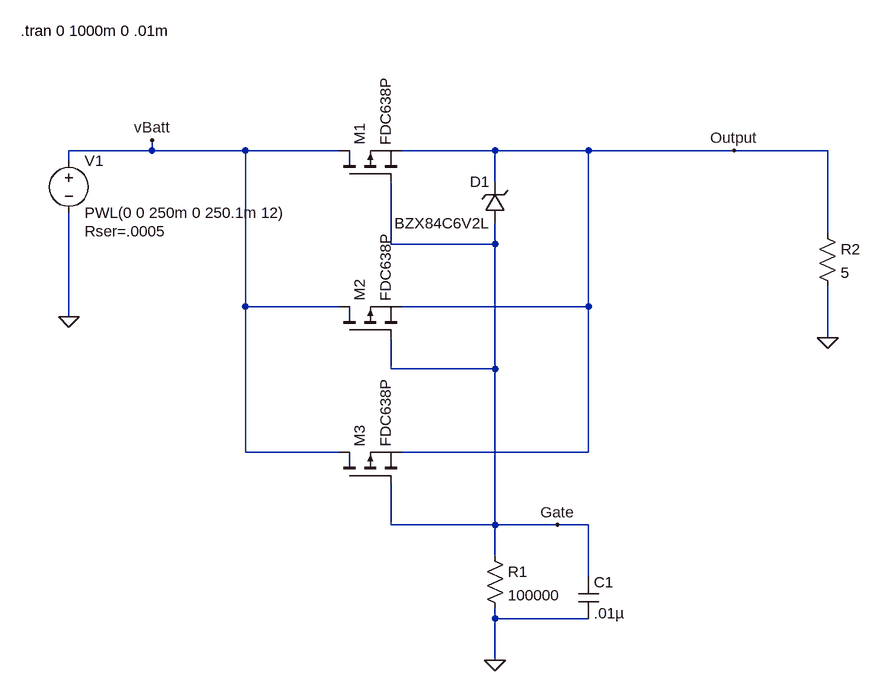
[diagram p0: schematic ReversePolarityProtection.asc]
ReversePolarityProtection.asc, the LTspice schematic file:
Version 4
SHEET 1 920 792
WIRE -176 -32 -176 -48
WIRE -176 -32 -304 -32
WIRE -32 -32 -176 -32
WIRE 112 -32 -32 -32
WIRE 352 -32 208 -32
WIRE 496 -32 352 -32
WIRE 720 -32 496 -32
WIRE 864 -32 720 -32
WIRE -304 -16 -304 -32
WIRE 352 16 352 -32
WIRE 864 96 864 -32
WIRE 192 112 192 16
WIRE 352 112 352 80
WIRE 352 112 192 112
WIRE -32 208 -32 -32
WIRE 112 208 -32 208
WIRE 496 208 496 -32
WIRE 496 208 208 208
WIRE -304 224 -304 64
WIRE 864 256 864 176
WIRE 192 304 192 256
WIRE 352 304 352 112
WIRE 352 304 192 304
WIRE -32 432 -32 208
WIRE 112 432 -32 432
WIRE 496 432 496 208
WIRE 496 432 208 432
WIRE 192 544 192 480
WIRE 352 544 352 304
WIRE 352 544 192 544
WIRE 448 544 352 544
WIRE 496 544 448 544
WIRE 352 592 352 544
WIRE 496 624 496 544
WIRE 352 688 352 672
WIRE 496 688 352 688
WIRE 352 752 352 688
FLAG 352 752 0
FLAG -304 224 0
FLAG 864 256 0
FLAG -176 -48 vBatt
FLAG 720 -32 Output
FLAG 448 544 Gate
SYMBOL pmos 112 16 R270
SYMATTR InstName M1
SYMATTR Value FDC638P
SYMBOL pmos 112 256 R270
SYMATTR InstName M2
SYMATTR Value FDC638P
SYMBOL pmos 112 480 R270
SYMATTR InstName M3
SYMATTR Value FDC638P
SYMBOL voltage -304 -32 R0
WINDOW 123 0 0 Left 2
WINDOW 39 24 124 Left 2
SYMATTR InstName V1
SYMATTR Value PWL(0 0 250m 0 250.1m 12)
SYMATTR SpiceLine Rser=.0005
SYMBOL zener 368 80 R180
WINDOW 0 24 64 Left 2
WINDOW 3 24 0 Left 2
SYMATTR InstName D1
SYMATTR Value BZX84C6V2L
SYMBOL res 336 576 R0
SYMATTR InstName R1
SYMATTR Value 100000
SYMATTR SpiceLine tol=5 pwr=.1
SYMBOL res 848 80 R0
SYMATTR InstName R2
SYMATTR Value 5
SYMATTR SpiceLine tol=5 pwr=200
SYMBOL cap 480 624 R0
SYMATTR InstName C1
SYMATTR Value .01µ
SYMATTR SpiceLine V=50
TEXT -378 -216 Left 2 !.tran 0 1000m 0 .01m

The netlist it stands for:
* ReversePolarityProtection.asc
M1 vBatt Gate Output Output FDC638P
M2 vBatt Gate Output Output FDC638P
M3 vBatt Gate Output Output FDC638P
V1 vBatt 0 PWL(0 0 250m 0 250.1m 12) Rser=.0005
D1 Gate Output BZX84C6V2L
R1 Gate 0 100000 tol=5 pwr=.1
R2 Output 0 5 tol=5 pwr=200
C1 Gate 0 .01µ V=50
.model D D
.lib standard.dio
.model NMOS NMOS
.model PMOS PMOS
.lib standard.mos
.tran 0 1000m 0 .01m
.backanno
.end